# Altium schematic sheet Composite-Module.SchDoc
size A4; SheetNumber: 1; SheetTotal: 2
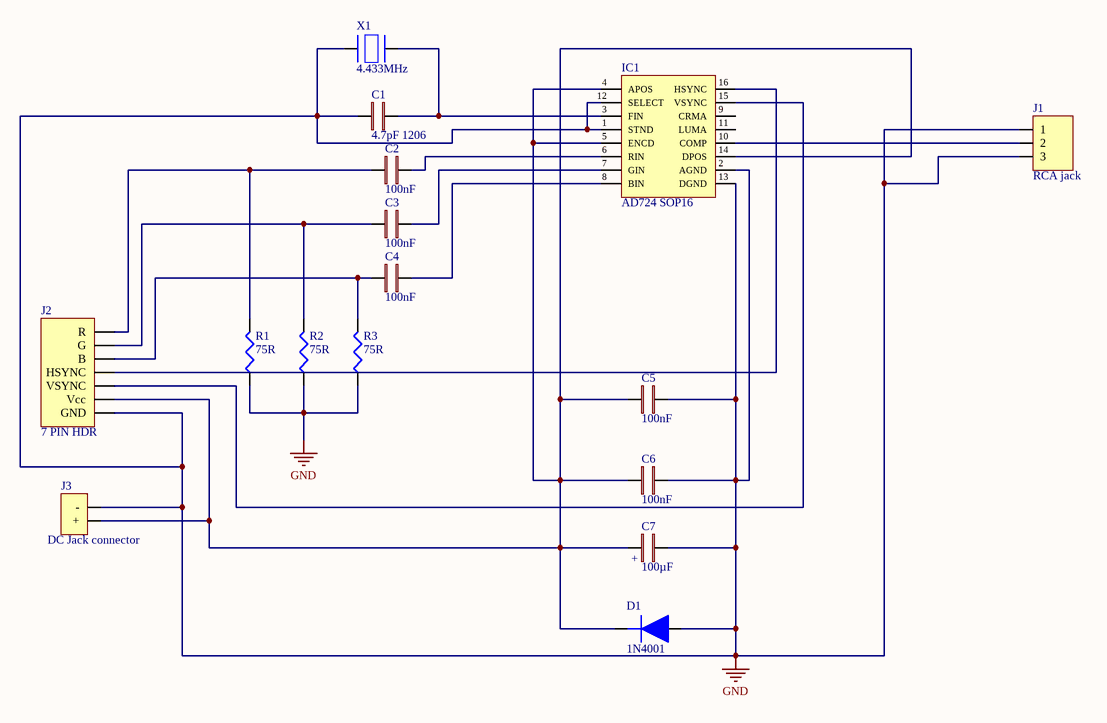
[diagram p0: Composite-Module.SchDoc]

## Parts
C1  4.7pF 1206  [CAPACITOR 1206]
C2  100nF  [CAPACITOR 1206]
C3  100nF  [CAPACITOR 1206]
C4  100nF  [CAPACITOR 1206]
C5  100nF  [CAPACITOR 1206]
C6  100nF  [CAPACITOR 1206]
C7  100µF  [ELCO]
D1  1N4001  [DIODE]
IC1  AD724 SOP16  [AD724]
J1  RCA jack  [RCA JACK]
J2  7 PIN HDR  [7 HDR]
J3  DC Jack connector  [DC JACK]
R1  75R  [Resistor 1206]
R2  75R  [Resistor 1206]
R3  75R  [Resistor 1206]
X1  4.433MHz  [XTAL 4.4436 MHz]

## Nets
GND: C1.2 C5.1 C6.1 C7.2(-) D1.1 IC1.1(STND) IC1.2(AGND) IC1.12(SELECT) IC1.13(DGND) J1.1 J1.3 J2.7(GND) J3.2(-) R1.1 R2.1 R3.1 X1.2
NetC1_1: C1.1 IC1.3(FIN) X1.1
NetC2_1: C2.1 IC1.6(RIN)
NetC2_2: C2.2 J2.1(R) R1.2
NetC3_1: C3.1 IC1.7(GIN)
NetC3_2: C3.2 J2.2(G) R2.2
NetC4_1: C4.1 IC1.8(BIN)
NetC4_2: C4.2 J2.3(B) R3.2
NetC5_2: C5.2 C6.2 C7.1(+) D1.2 IC1.4(APOS) IC1.5(ENCD) IC1.14(DPOS) J2.6(Vcc) J3.1(+)
NetIC1_10: IC1.10(COMP) J1.2
NetIC1_15: IC1.15(VSYNC) J2.5(VSYNC)
NetIC1_16: IC1.16(HSYNC) J2.4(HSYNC)

Not connected (* = marked no-connect by the designer): IC1 9(CRMA) 11(LUMA)

## Library data of the parts
C1 = Capacitor: 4.7pF: 1206 4.7 pF 50 V ±0.25 pF Tolerance C0G/NP0 SMT Multilayer Ceramic Capacitor; Manufacturer: Kyocera AVX; Manufacturer Part Number: 12065A4R7CAT2A; Voltage Rating: 50V; Dielectric: C0G; Dissipation Factor: 2.5%; Supplier 1: Rs; RoHS: Yes; Category: Ceramic Capacitors; Stock 1: 1800; Pricing 1: 100=0,19200, 500=0,13300, 1000=0,11900 (EUR); Mount: Surface Mount; Case/Package: 1206; Case Code (Imperial): 1206; Case Code (Metric): 3216; Min Operating Temperature: -55°C; Max Operating Temperature: 125°C; Capacitance: 4.7pF; Package Quantity: 1; Voltage Rating (DC): 50V; Packaging: Tape and Reel; Series: -; Termination: SMD/SMT; Construction: Flat; Length: 3.2mm; Width: 1.6mm; Height: 0.5mm; Thickness: 0.037inch; Depth: 1.6mm; Radiation Hardening: No; RoHS Compliant: Yes; Lead Free: Lead Free; ComponentLink1URL: https://datasheet.ciiva.com/152/ccog-152054.pdf?src-supplier=Digi-Key; ComponentLink1Description: https://datasheet.ciiva.com/152/ccog-152054.pdf?src-supplier=Digi-Key; ComponentLink2URL: https://datasheet.ciiva.com/152/ccog-152055.pdf?src-supplier=Digi-Key; ComponentLink2Description: https://datasheet.ciiva.com/152/ccog-152055.pdf?src-supplier=Digi-Key; ComponentLink3URL: https://datasheet.ciiva.com/11551/ccog-11551671.pdf?src-supplier=Avnet; ComponentLink3Description: https://datasheet.ciiva.com/11551/ccog-11551671.pdf?src-supplier=Avnet; ComponentLink4URL: https://datasheet.ciiva.com/152/ccog-152056.pdf?src-supplier=Digi-Key; ComponentLink4Description: https://datasheet.ciiva.com/152/ccog-152056.pdf?src-supplier=Digi-Key; ComponentLink5URL: https://datasheet.ciiva.com/16390/ccog-16390684.pdf?src-supplier=Future+Electronics; ComponentLink5Description: https://datasheet.ciiva.com/16390/ccog-16390684.pdf?src-supplier=Future+Electronics; Supplier Part Number 1: 1356810
C2-C6 = Capacitor: 100nF: Ceramic capacitor SMD-1206 100nF /50V X7R# K +-10%, AVX, RoHS, /4000 reel/; Manufacturer: Kyocera AVX; Manufacturer Part Number: 12065C104KAT2A; Tolerance: 10%; Voltage Rating: 50V; Dielectric: X7R; Insulation Resistance: 100GR; Dissipation Factor: 2.5%; Supplier 1: Farnell; RoHS: Yes; Category: Ceramic Capacitors; Stock 1: 188000; Pricing 1: 4000=0,02600, 20000=0,02520, 40000=0,02440 (EUR); Mount: Surface Mount,PCB; Case/Package: 1206; Number of Pins: 2; Case Code (Metric): 3216; Case Code (Imperial): 1206; Dielectric Material: Ceramic; Contact Plating: Tin,Matte; Min Operating Temperature: -55°C; Max Operating Temperature: 125°C; Packaging: Tape and Reel; Capacitance: 100nF; Voltage Rating (DC): 50V; Voltage: 50V; Series: -; Package Quantity: 1; Termination: SMD/SMT; Construction: Flat; Length: 3.2mm; Width: 1.6mm; Height: 0.94mm; Depth: 1.6mm; Thickness: 0.037inch; Radiation Hardening: No; Lead Free: Lead Free; RoHS Compliant: Yes; Reach SVHC Compliant: Yes; ComponentLink1URL: https://datasheet.ciiva.com/11786/0900766b80ed4be2-11786988.pdf?src-supplier=Rs; ComponentLink1Description: https://datasheet.ciiva.com/11786/0900766b80ed4be2-11786988.pdf?src-supplier=Rs; ComponentLink2URL: https://datasheet.ciiva.com/2988/cx7r-2988135.pdf?src-supplier=Avnet; ComponentLink2Description: https://datasheet.ciiva.com/2988/cx7r-2988135.pdf?src-supplier=Avnet; ComponentLink3URL: https://datasheet.ciiva.com/16375/cx7r-16375719.pdf?src-supplier=Future+Electronics; ComponentLink3Description: https://datasheet.ciiva.com/16375/cx7r-16375719.pdf?src-supplier=Future+Electronics; ComponentLink4URL: https://datasheet.ciiva.com/2988/cx7r-2988136.pdf?src-supplier=Avnet; ComponentLink4Description: https://datasheet.ciiva.com/2988/cx7r-2988136.pdf?src-supplier=Avnet; ComponentLink5URL: https://datasheet.ciiva.com/7833/cx7r-7833405.pdf?src-supplier=Element14; ComponentLink5Description: https://datasheet.ciiva.com/7833/cx7r-7833405.pdf?src-supplier=Element14; ComponentLink6URL: https://datasheet.ciiva.com/25796/cx7r-25796358.pdf?src-supplier=Farnell; ComponentLink6Description: https://datasheet.ciiva.com/25796/cx7r-25796358.pdf?src-supplier=Farnell; ComponentLink7URL: https://datasheet.ciiva.com/7833/cx7r-7833402.pdf?src-supplier=Element14; ComponentLink7Description: https://datasheet.ciiva.com/7833/cx7r-7833402.pdf?src-supplier=Element14; ComponentLink8URL: https://datasheet.ciiva.com/150/cx7r-150390.pdf?src-supplier=Digi-Key; ComponentLink8Description: https://datasheet.ciiva.com/150/cx7r-150390.pdf?src-supplier=Digi-Key; ComponentLink9URL: https://datasheet.ciiva.com/150/cx7r-150389.pdf?src-supplier=Digi-Key; ComponentLink9Description: https://datasheet.ciiva.com/150/cx7r-150389.pdf?src-supplier=Digi-Key; ComponentLink10URL: https://datasheet.ciiva.com/150/cx7r-150391.pdf?src-supplier=Digi-Key; ComponentLink10Description: https://datasheet.ciiva.com/150/cx7r-150391.pdf?src-supplier=Digi-Key; ComponentLink11URL: https://datasheet.ciiva.com/7833/cx7r-7833403.pdf?src-supplier=Element14; ComponentLink11Description: https://datasheet.ciiva.com/7833/cx7r-7833403.pdf?src-supplier=Element14; ComponentLink12URL: https://datasheet.ciiva.com/7833/cx7r-7833404.pdf?src-supplier=Element14; ComponentLink12Description: https://datasheet.ciiva.com/7833/cx7r-7833404.pdf?src-supplier=Element14; ComponentLink13URL: https://datasheet.ciiva.com/5415/cx7r-218113-5415909.pdf?src-supplier=Mouser; ComponentLink13Description: https://datasheet.ciiva.com/5415/cx7r-218113-5415909.pdf?src-supplier=Mouser; ComponentLink14URL: https://datasheet.ciiva.com/14584/70001075-14584956.pdf?src-supplier=Allied+Electronics; ComponentLink14Description: https://datasheet.ciiva.com/14584/70001075-14584956.pdf?src-supplier=Allied+Electronics; Supplier Part Number 1: 2281081
C7 = Capacitor: 100µF (elco): CAP ALUM 100UF 20% 10V SMD; Manufacturer: Panasonic; Manufacturer Part Number: EEE-1AA101WR; Ripple Current: 50mA; Life (Hours): 1000Hour; Supplier 1: Rs; RoHS: Yes; Category: Aluminum Electrolytic Capacitors; Stock 1: 2900; Pricing 1: 50=0,23400, 250=0,13800, 500=0,11000 (EUR); Mount: Surface Mount,PCB; Case/Package: Radial; Contact Plating: Tin; Min Operating Temperature: -40°C; Max Operating Temperature: 85°C; Capacitance: 100uF; Voltage Rating: 10V; Tolerance: 20%; Packaging: Tape and Reel; Package Quantity: 1000; Voltage Rating (DC): 10V; Termination: SMD/SMT; Series: S; Construction: Cylindrical; Ripple Current (AC): 50mA; Diameter: 5mm; Length: 5.5mm; Height: 5.4mm; Height - Seated (Max): 0.213inch; Ratings: AEC-Q200; Radiation Hardening: No; RoHS Compliant: Yes; Lead Free: Lead Free; ComponentLink1URL: https://datasheet.ciiva.com/26945/getdatasheetpartid-169213-26945071.pdf?src-supplier=Verical; ComponentLink1Description: https://datasheet.ciiva.com/26945/getdatasheetpartid-169213-26945071.pdf?src-supplier=Verical; ComponentLink2URL: https://datasheet.ciiva.com/24027/aba0000ce2-40801-24027541.pdf?src-supplier=Mouser; ComponentLink2Description: https://datasheet.ciiva.com/24027/aba0000ce2-40801-24027541.pdf?src-supplier=Mouser; ComponentLink3URL: https://datasheet.ciiva.com/14598/70255710-14598233.pdf?src-supplier=Allied+Electronics; ComponentLink3Description: https://datasheet.ciiva.com/14598/70255710-14598233.pdf?src-supplier=Allied+Electronics; ComponentLink4URL: https://datasheet.ciiva.com/14605/70255710-14605689.pdf?src-supplier=Allied+Electronics; ComponentLink4Description: https://datasheet.ciiva.com/14605/70255710-14605689.pdf?src-supplier=Allied+Electronics; ComponentLink5URL: https://datasheet.ciiva.com/11673/aba0000ce2-11673882.pdf?src-supplier=Avnet; ComponentLink5Description: https://datasheet.ciiva.com/11673/aba0000ce2-11673882.pdf?src-supplier=Avnet; ComponentLink6URL: https://datasheet.ciiva.com/16427/aba0000ce2-16427544.pdf?src-supplier=Future+Electronics; ComponentLink6Description: https://datasheet.ciiva.com/16427/aba0000ce2-16427544.pdf?src-supplier=Future+Electronics; ComponentLink7URL: https://datasheet.ciiva.com/2983/aba0000ce2-2983906.pdf?src-supplier=Avnet; ComponentLink7Description: https://datasheet.ciiva.com/2983/aba0000ce2-2983906.pdf?src-supplier=Avnet; ComponentLink8URL: https://datasheet.ciiva.com/30075/11aba0000ce2-30075303.pdf?src-supplier=Onlinecomponents.com; ComponentLink8Description: https://datasheet.ciiva.com/30075/11aba0000ce2-30075303.pdf?src-supplier=Onlinecomponents.com; Supplier Part Number 1: 1766372
D1 = Diode: 1N4001: Rectifier Diode Switching 100V 1A 2000ns 2-Pin SMA T/R; Manufacturer: MCC; Manufacturer Part Number: GS1B-LTP; Forward Voltage: 1V; Max Reverse Current: 50uA; Peak Non-Repetitive Surge Current: 30A; Element Configuration: Single; Reverse Recovery Time: 2us; Supplier 1: Arrow Electronics; RoHS: Yes; Category: Rectifier Diodes; Stock 1: 4511; Pricing 1: 1=0,24370, 10=0,20390, 25=0,20230, 100=0,11440, 250=0,11330, 500=0,07600, 1000=0,05260, 3000=0,03660 (USD); Mount: Surface Mount; Case/Package: DO-214AC; Number of Pins: 2; Min Operating Temperature: -55°C; Max Operating Temperature: 150°C; Packaging: Tape and Reel; Package Quantity: 1; Average Rectified Current: 1A; Max Reverse Voltage (DC): 100V; Series: GS1B; Max Surge Current: 30A; Reverse Voltage: 100V; Lead Free: Lead Free; RoHS Compliant: Yes; ComponentLink1URL: https://datasheet.ciiva.com/911/gs1a-lgs1m-ldo-214ac-911885.pdf?src-supplier=Digi-Key; ComponentLink1Description: https://datasheet.ciiva.com/911/gs1a-lgs1m-ldo-214ac-911885.pdf?src-supplier=Digi-Key; ComponentLink2URL: https://datasheet.ciiva.com/911/gs1a-lgs1m-ldo-214ac-911886.pdf?src-supplier=Digi-Key; ComponentLink2Description: https://datasheet.ciiva.com/911/gs1a-lgs1m-ldo-214ac-911886.pdf?src-supplier=Digi-Key; ComponentLink3URL: https://datasheet.ciiva.com/911/gs1a-lgs1m-ldo-214ac-911887.pdf?src-supplier=Digi-Key; ComponentLink3Description: https://datasheet.ciiva.com/911/gs1a-lgs1m-ldo-214ac-911887.pdf?src-supplier=Digi-Key; Supplier Part Number 1: GS1B-LTP
IC1 = IC: AD724: RGB to NTSC and PAL Encoder 16-Pin SOIC W Tube; Manufacturer: Analog Devices; Manufacturer Part Number: AD724JRZ; Min Supply Voltage: 4.75V; Max Supply Voltage: 5.25V; Number of Channels: 3; Max Power Dissipation: 800mW; Operating Supply Voltage: 5V; Nominal Supply Current: 33mA; Bandwidth: 5MHz; Operating Supply Current: 42mA; Supplier 1: Farnell; RoHS: Yes; Category: Decoders and Multiplexers; Stock 1: 46; Pricing 1: 1=20,54000, 10=18,88000, 47=18,10000, 141=15,95000, 282=15,17000, 517=14,19000 (EUR); Mount: Surface Mount; Case/Package: SOIC; Number of Pins: 16; Contact Plating: Tin,Matte; Min Operating Temperature: 0°C; Max Operating Temperature: 70°C; Package Quantity: 47; Packaging: Rail/Tube; Series: -; Supply Current: 33mA; Length: 10.5mm; Width: 7.6mm; Height: 2.35mm; Lead Free: Contains Lead; RoHS Compliant: Yes; Reach SVHC Compliant: Yes; ComponentLink1URL: https://datasheet.ciiva.com/1778/ad724-1778742.pdf?src-supplier=Digi-Key; ComponentLink1Description: https://datasheet.ciiva.com/1778/ad724-1778742.pdf?src-supplier=Digi-Key; ComponentLink2URL: https://datasheet.ciiva.com/1140/83869-1140251.pdf?src-supplier=Element14; ComponentLink2Description: https://datasheet.ciiva.com/1140/83869-1140251.pdf?src-supplier=Element14; ComponentLink3URL: https://datasheet.ciiva.com/3245/ad724-3245391.pdf?src-supplier=Avnet; ComponentLink3Description: https://datasheet.ciiva.com/3245/ad724-3245391.pdf?src-supplier=Avnet; Supplier Part Number 1: 4023716
J1 = Connector: RCA female: Conn RCA RCP 4 POS Solder RA SMD 2 Terminal 1 Port T/R; Manufacturer: CUI; Manufacturer Part Number: RCJ-014-SMT-TR; Body Material: Steel; Body Color: Silver; Gender: Female; Shielding: Unshielded; Supplier 1: Arrow Electronics; RoHS: No; Category: Uncategorized; Mount: Surface Mount; Case/Package: Metal; Contact Plating: Tin; Insulation Color: Yellow; Series: RCJ; Packaging: Tape and Reel; Termination: Solder; RoHS Compliant: No; ComponentLink1URL: https://datasheet.ciiva.com/7368/rcj-01x-smt-7368731.pdf?src-supplier=Digi-Key; ComponentLink1Description: https://datasheet.ciiva.com/7368/rcj-01x-smt-7368731.pdf?src-supplier=Digi-Key; ComponentLink2URL: https://datasheet.ciiva.com/7368/rcj-01x-smt-7368734.pdf?src-supplier=Digi-Key; ComponentLink2Description: https://datasheet.ciiva.com/7368/rcj-01x-smt-7368734.pdf?src-supplier=Digi-Key; Supplier Part Number 1: RCJ-014-SMT-TR
J2 = CONNECTOR: 7 PIN HDR: 7 pin header
J3 = Connector: DC Jack: 2.0 x 6.5 mm, 2.5 A, Horizontal, Through Hole, Dc Power Jack Connector; Manufacturer: CUI; Manufacturer Part Number: PJ-002A; Gender: Male; Shielding: Unshielded; Current Rating: 2.5A; Insulation Resistance: 50MR; Voltage Rating: 24V; Number of Conductors: 2; Supplier 1: Arrow Electronics; RoHS: Yes; Category: Uncategorized; Mount: Through Hole; Color: Black; Contact Material: Copper Alloy,Copper; Contact Plating: Tin,Nickel; Housing Material: Thermoplastic; Housing Color: Black; Min Operating Temperature: -25°C; Max Operating Temperature: 85°C; Package Quantity: 500; Termination: Through Hole; Connector Type: Jack; Contact Gender: Male; Packaging: Bulk; Series: -; Orientation: Horizontal; Diameter: 2.1mm; RoHS Compliant: Yes; Flammability Rating: UL94 V-0; Lead Free: Lead Free; ComponentLink1URL: http://www.mouser.com/ds/2/670/pj-002a-515880.pdf?src-supplier=Mouser; ComponentLink1Description: http://www.mouser.com/ds/2/670/pj-002a-515880.pdf?src-supplier=Mouser; ComponentLink2URL: http://www.cui.com/Product/Resource/FuturePDF/PJ-002A.pdf?src-supplier=Future+Electronics; ComponentLink2Description: http://www.cui.com/Product/Resource/FuturePDF/PJ-002A.pdf?src-supplier=Future+Electronics; ComponentLink3URL: https://www.cui.com/product/resource/digikeypdf/pj-002a.pdf?src-supplier=Digi-Key; ComponentLink3Description: https://www.cui.com/product/resource/digikeypdf/pj-002a.pdf?src-supplier=Digi-Key; Supplier Part Number 1: PJ-002A
R1-R3 = Resistor: 75R: Res Thin Film 1206 75 Ohm 0.1% 1/4W ±25ppm/°C Molded SMD SMD Punched Carrier T/R; Manufacturer: Panasonic; Manufacturer Part Number: ERA-8AEB750V; Power Rating: 250mW; Voltage Rating: 150V; Supplier 1: Farnell; RoHS: Yes; Category: Chip SMD Resistors; Stock 1: 2826; Pricing 1: 10=0,39700, 100=0,17300, 500=0,14200, 1000=0,14100, 2500=0,13900, 5000=0,13800, 25000=0,13600, 50000=0,13500 (EUR); Mount: Surface Mount; Case/Package: 1206; Number of Pins: 2; Case Code (Metric): 3216; Case Code (Imperial): 1206; Contact Plating: Tin; Min Operating Temperature: -55°C; Max Operating Temperature: 155°C; Resistance: 75R; Tolerance: 0.1%; Package Quantity: 5000; Packaging: Tape and Reel; Resistor Type: Thin Film,Metal Film; Termination: SMD/SMT; Temperature Coefficient: 25ppm/°C; Series: ERA-8A; Resistance Tolerance: 0.1%; Number of Terminations: 2; Max Power Dissipation: 250mW; Construction: Rectangular; Features: Automotive AEC-Q200; Voltage Rating (DC): 150V; Technology: THIN FILM; Length: 3.2mm; Width: 1.6mm; Height: 0.6mm; Depth: 1.6mm; Ratings: AEC-Q200; Radiation Hardening: No; Lead Free: Lead Free; Military Standard: Not; RoHS Compliant: Yes; Reach SVHC Compliant: Yes; ComponentLink1URL: https://datasheet.ciiva.com/48529/era-eng-tds-48529837.pdf?src-supplier=Distrelec; ComponentLink1Description: https://datasheet.ciiva.com/48529/era-eng-tds-48529837.pdf?src-supplier=Distrelec; ComponentLink2URL: https://datasheet.ciiva.com/24061/aoa0000ce26-197354-24061558.pdf?src-supplier=Mouser; ComponentLink2Description: https://datasheet.ciiva.com/24061/aoa0000ce26-197354-24061558.pdf?src-supplier=Mouser; ComponentLink3URL: https://datasheet.ciiva.com/9187/aoa0000ce26-9187734.pdf?src-supplier=Avnet; ComponentLink3Description: https://datasheet.ciiva.com/9187/aoa0000ce26-9187734.pdf?src-supplier=Avnet; Supplier Part Number 1: 1841731
X1 = Crystal: 4.433MHz: Crystal 10MHz 30pF 2-Pin HC-49/U Loose; Manufacturer: Multicomp; Manufacturer Part Number: HC49S-10-30-50-70-30-ATF; Frequency Tolerance: 30ppm; Frequency Stability: 50ppm; Supplier 1: Farnell; RoHS: Yes; Category: Crystals; Stock 1: 320; Pricing 1: 1=0,39200, 2=0,35100, 3=0,31800, 5=0,31100, 10=0,30300, 20=0,27800, 50=0,25900, 100=0,23300 (EUR); Mount: Through Hole; Number of Pins: 2; Min Operating Temperature: -20°C; Max Operating Temperature: 70°C; Frequency: 10MHz; Load Capacitance: 30pF; Reach SVHC Compliant: Yes; RoHS Compliant: Yes; ComponentLink1URL: http://www.farnell.com/datasheets/1661828.pdf?src-supplier=Farnell; ComponentLink1Description: http://www.farnell.com/datasheets/1661828.pdf?src-supplier=Farnell; ComponentLink2URL: http://www.farnell.com/datasheets/1661828.pdf?src-supplier=Element14; ComponentLink2Description: http://www.farnell.com/datasheets/1661828.pdf?src-supplier=Element14; Supplier Part Number 1: 1666999